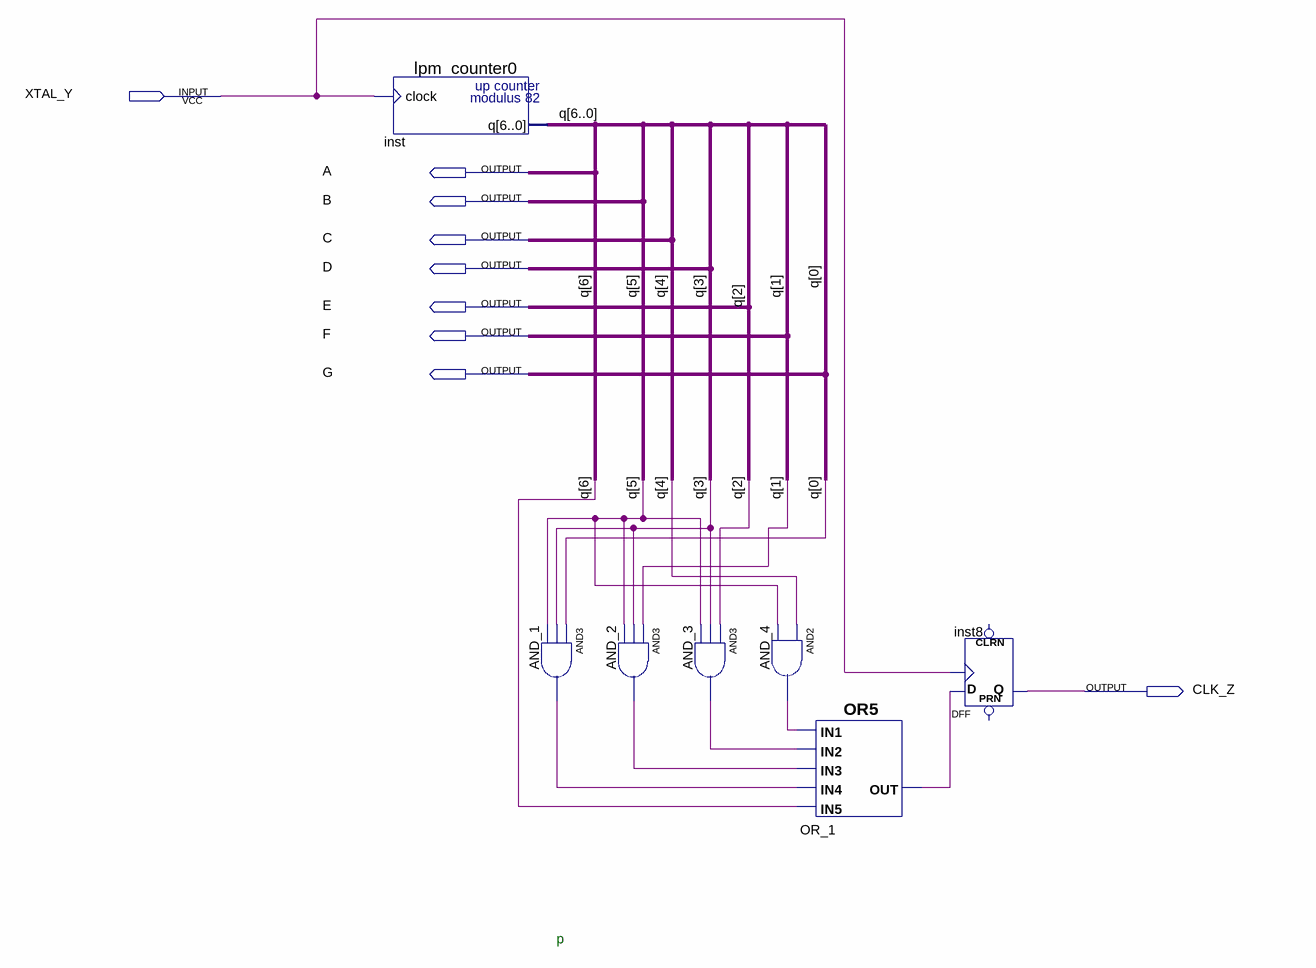
[diagram p0: schematic sheet]
// Quartus schematic design1TN.bdf as structural Verilog: 7 symbols, 9 pins
module design1TN (
  input  XTAL_Y,
  output A,
  output B,
  output C,
  output D,
  output E,
  output F,
  output G,
  output CLK_Z
);

  wire AND_1_out, AND_2_out, AND_3_out, AND_4_out, OR_1_out;
  wire [6:3] q;

  lpm_counter0 inst (.clock(XTAL_Y), .q({q, E, F, G}));
  and AND_1 (AND_1_out, G, q[3], q[5]);
  and AND_2 (AND_2_out, F, q[3], q[5]);
  and AND_3 (AND_3_out, E, q[3], q[5]);
  and AND_4 (AND_4_out, q[4], q[5]);
  or OR_1 (OR_1_out, AND_4_out, AND_3_out, AND_2_out, AND_1_out, q[6]);
  DFF inst8 (.CLK(XTAL_Y), .D(OR_1_out), .Q(CLK_Z));  // open: CLRN, PRN

  // Other names for the same wires on the sheet: q[2:0] = {E, F, G}

  // Notes on the sheet:
  //   p
endmodule
